# EAGLE design driver motor (EAGLE 6.6.0)
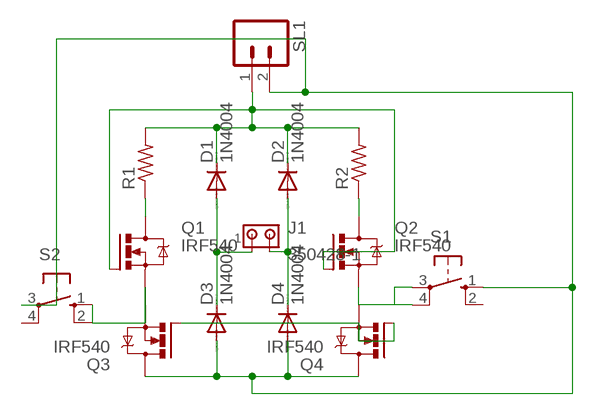
[diagram p0: schematic, sheet 1]

## Parts
D1  1N4004  [DO41-10]
D2  1N4004  [DO41-10]
D3  1N4004  [DO41-10]
D4  1N4004  [DO41-10]
J1  350428-1  [350428-1]
Q1  IRF540  [TO220BV]
Q2  IRF540  [TO220BV]
Q3  IRF540  [TO220BV]
Q4  IRF540  [TO220BV]
R1  R-US_0207/7  [0207/7]
R2  R-US_0207/7  [0207/7]
S1  10-XX  [B3F-10XX]
S2  10-XX  [B3F-10XX]
SL1  M02  [02P]

## Nets
N$1: D1.C D2.C Q1.G Q2.G R1.2 R2.2 SL1.1
N$2: D1.A D3.C J1.1
N$3: D2.A D4.C J1.2
N$4: D3.A D4.A Q3.D Q4.D S1.1(S) S2.3(P) SL1.2
N$6: Q3.G Q4.G
N$7: Q2.S Q4.S S1.3(P) S1.4(P1)
N$9: Q1.D R1.1
N$10: Q2.D R2.1
N$12: Q1.S Q3.S S2.1(S) S2.2(S1)
Unconnected: S1.2(S1) S2.4(P1)

## Library data of the parts
D1-D4 = diode:1N4004: DIODE general purpose rectifier, 1 A
J1 = con-amp:350428-1: Universal MATE-N-LOK .250" Centerline, 600 V, 19 - 36 A max Source: http://catalog.tycoelectronics.com/ .. ENG_CD_350428_Y.pdf
Q1-Q4 = transistor-power:IRF540: HEXFET Power MOSFET
R1 R2 = resistor:R-US_: RESISTOR, American symbol
S1 S2 = switch-omron:10-XX: OMRON SWITCH; MPN: B3F-1000; OC_FARNELL: 176432; OC_NEWARK: 36M3542
SL1 = con-amp-quick:M02: AMP QUICK CONNECTOR; OC_FARNELL: unknown; OC_NEWARK: unknown

## Board
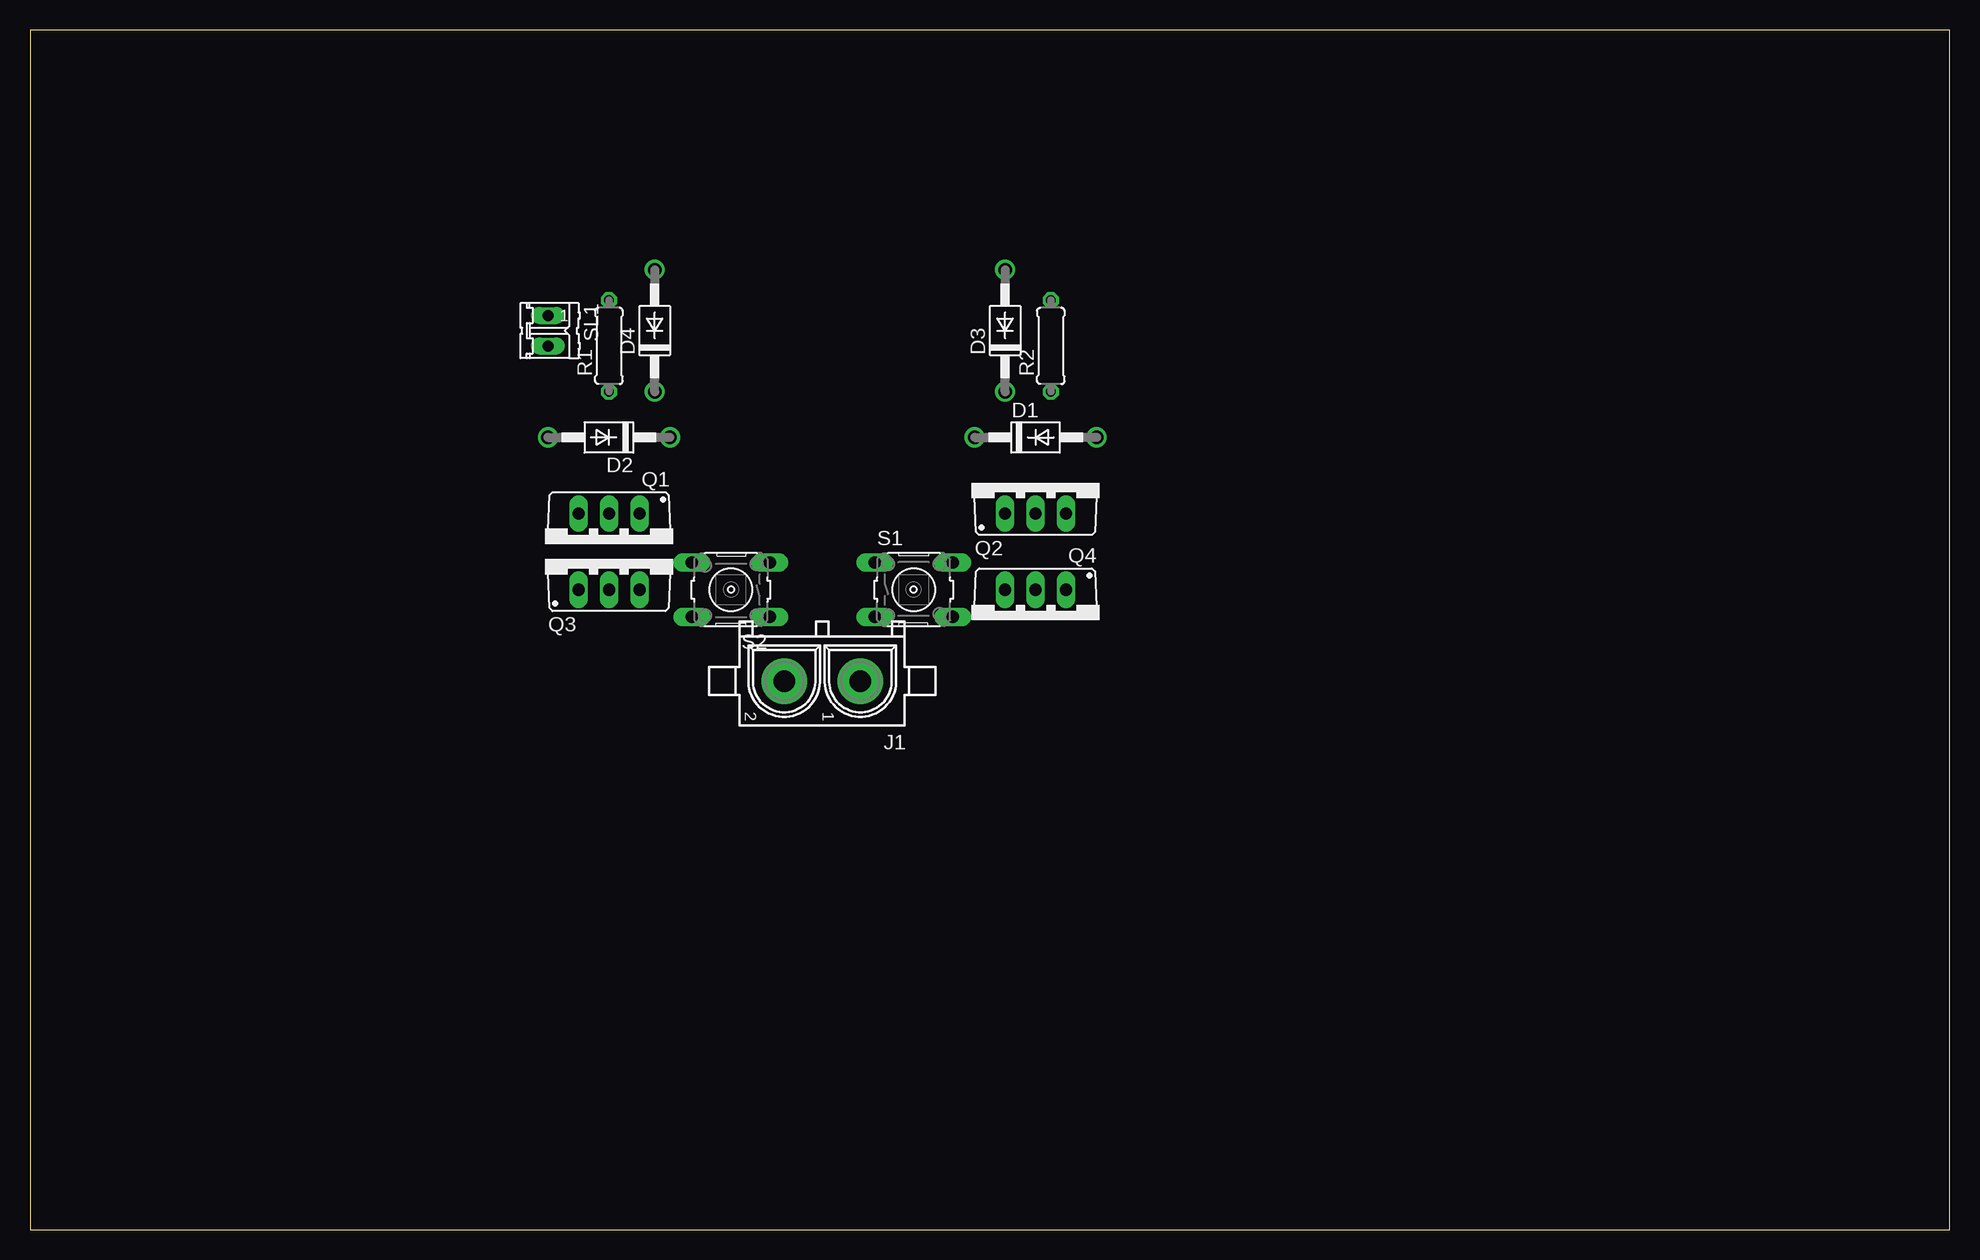
[diagram p1: board, top side]
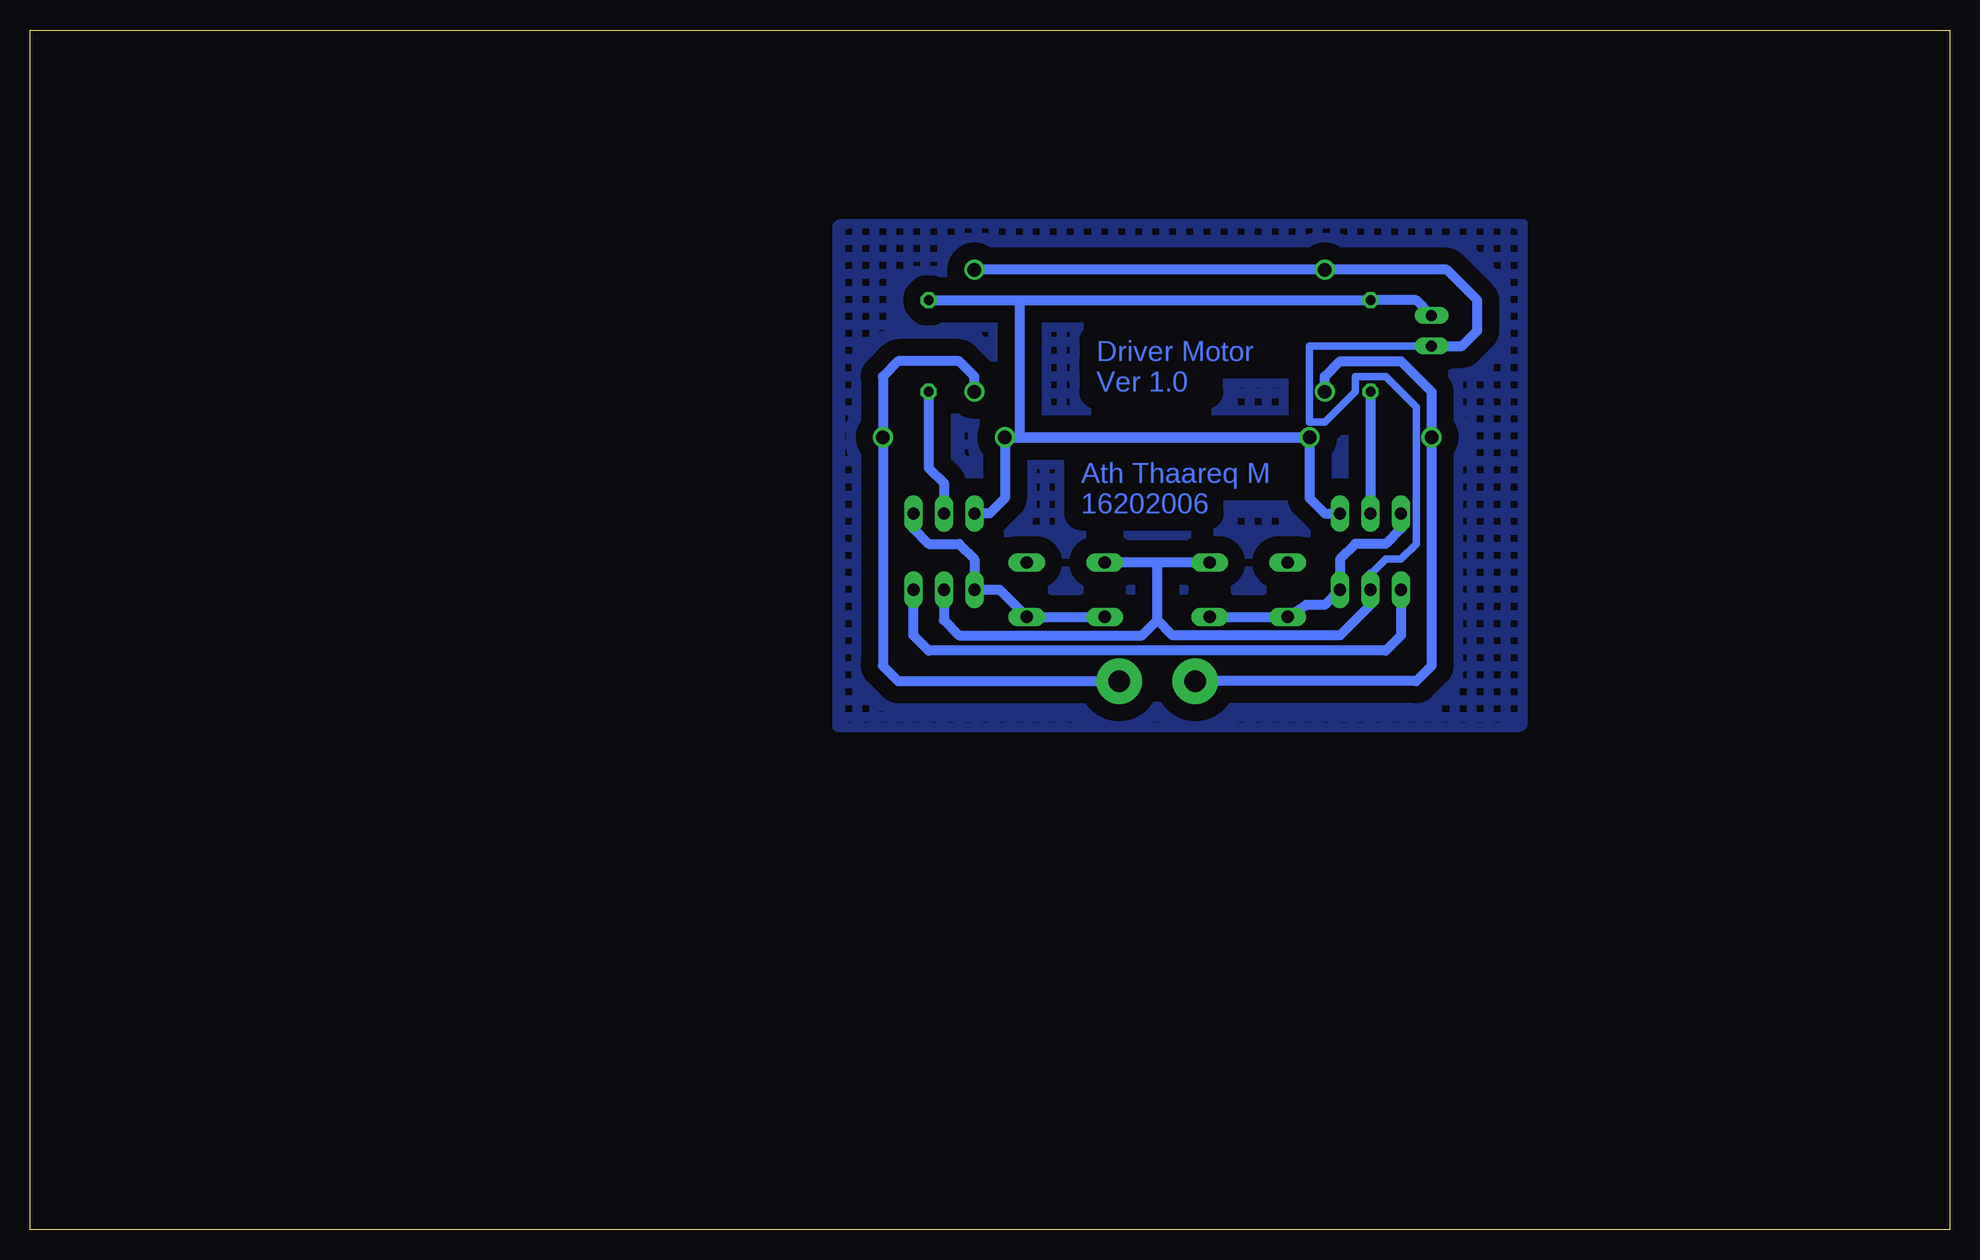
[diagram p2: board, bottom side, seen from below]

Size 160 x 100 mm. Coordinates in mm from the lower left corner, seen from the top.
Outline: 0,0 160,0 160,100 0,100 0,0
Copper layers (1*16): Top 0.035mm / dielectric 1.5mm / Bottom 0.035mm
Design rules "default": minimum track width 10mil, minimum drill 24mil, track to track 8mil, track to pad 8mil, pad to pad 8mil, via to via 8mil, smd to smd 8mil, copper to edge 40mil, drill to drill 8mil, minimum pad ring 10mil, minimum via ring 8mil, stop-mask expansion 4mil, vias tented up to drill 0mil, thermal gap 10mil

### Footprints (pad centres in the part's own frame; a part is rotated, then mirrored left to right if it is on the bottom)
DO41-10 = drill 1.118: A 5.08,0; C -5.08,0
350428-1 = drill 1.8 pad 3.81: 1 -3.175,0; 2 3.175,0
TO220BV = drill 1.016 long: D 0,-2.54; G -2.54,-2.54; S 2.54,-2.54
0207/7 = drill 0.813 octagon: 1 -3.81,0; 2 3.81,0
B3F-10XX = drill 1.016 long: 1 -3.251,2.261; 2 3.251,2.261; 3 -3.251,-2.261; 4 3.251,-2.261
02P = drill 0.914 long: 1 -1.27,0; 2 1.27,0

### Placement (x,y rotation side)
D1  83.82,66.04 0 top
D2  48.26,66.04 180 top
D3  81.28,74.93 90 top
D4  52.07,74.93 90 top
J1  66.04,45.72 180 top
Q1  48.26,57.15 180 top
Q2  83.82,62.23 0 top
Q3  48.26,55.88 0 top
Q4  83.82,50.8 180 top
R1  48.26,73.66 90 top
R2  85.09,73.66 90 top
S1  73.66,53.34 0 top
S2  58.42,53.34 180 top
SL1  43.18,74.93 270 top

### Tracks (layer width: path | path; a pad name or v marks a point on that pad's centre or on a via)
N$1
  Bottom 0.813: SL1.1 44.45,77.47 R1.2 77.47,77.47 | R2.2 77.47,77.47 | D2.C 77.47,66.04 77.47,77.47 | Q2.G 80.01,59.69 78.74,60.96 D1.C D2.C | D2.C 53.34,60.96 52.07,59.69 Q1.G
N$2
  Bottom 0.813: D3.C 81.28,71.12 82.55,72.39 87.63,72.39 88.9,71.12 D1.A 88.9,46.99 87.63,45.72 J1.1
N$3
  Bottom 0.813: D4.C 52.07,71.12 50.8,72.39 45.72,72.39 43.18,69.85 D2.A 43.18,46.99 44.45,45.72 J1.2
N$4
  Bottom 0.61: Q3.D 48.26,54.61 46.99,55.88 45.72,55.88 44.45,57.15 44.45,68.58 46.99,71.12 49.53,71.12 49.53,69.85 52.07,67.31 53.34,67.31 53.34,73.66 SL1.2
  Bottom 0.813: D3.A D4.A 41.91,80.01 39.37,77.47 39.37,74.93 40.64,73.66 SL1.2 | S2.3 66.04,55.6 | 66.04,55.6 S1.1 | Q4.D 83.82,50.8 82.55,49.53 67.31,49.53 66.04,50.8 | 66.04,50.8 66.04,55.6 | 48.26,54.61 48.26,52.07 50.8,49.53 64.77,49.53 66.04,50.8
N$5
  pour Bottom (isolate 1.422, hatched): 44.45,83.82 92.39,83.82 arc-90 92.71,83.5 92.71,41.91 35.88,41.91 arc-90 35.56,42.23 35.56,83.82
N$6
  Bottom 0.813: Q3.G 45.72,49.53 46.99,48.26 85.09,48.26 86.36,49.53 Q4.G
N$7
  Bottom 0.813: Q2.S 86.36,58.42 85.09,57.15 82.55,57.15 81.28,55.88 Q4.S 79.17,53.34 S1.4 S1.3
N$9
  Bottom 0.813: R1.1 Q1.D
N$10
  Bottom 0.813: R2.1 85.09,63.5 83.82,62.23 Q2.D
N$12
  Bottom 0.813: Q1.S 45.72,58.42 46.99,57.15 49.53,57.15 50.8,55.88 Q3.S 52.07,52.07 53.62,52.07 S2.2 S2.1

### Text on the board
Bottom: Driver Motor | Ver 1.0 | Ath Thaareq M | 16202006